# EAGLE design Gesture_rf_controller_v1 (EAGLE 7.1.0)
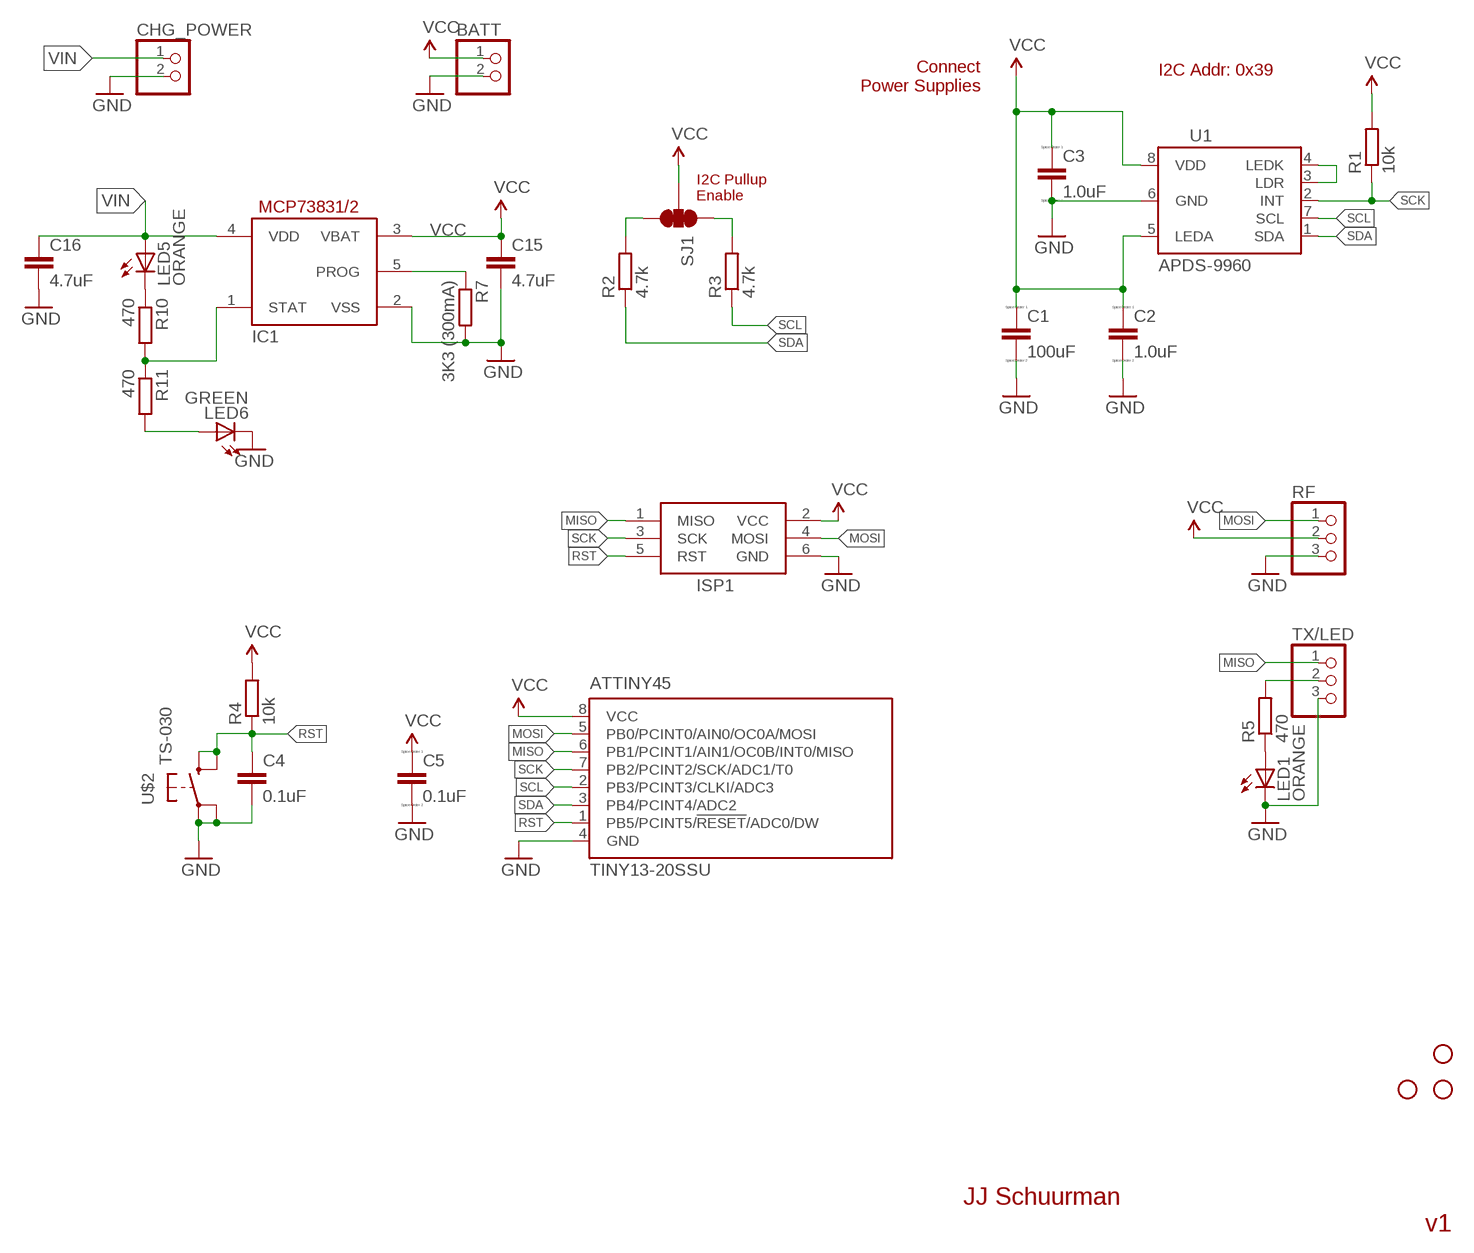
[diagram p0: schematic, sheet 1]

## Parts
ATTINY45  TINY13-20SSU  [8S1]
BATT  PINHD-1X2  [1X02]
C1  100uF  C-EUC0805  [C0805]
C2  1.0uF  C-EUC0805  [C0805]
C3  1.0uF  C-EUC0805  [C0805]
C4  0.1uF  C-EUC1206  [C1206]
C5  0.1uF  C-EUC0805  [C0805]
C15  4.7uF  C-EUC0805K  [C0805K]
C16  4.7uF  C-EUC0805K  [C0805K]
CHG_POWER  PINHD-1X2  [1X02]
IC1  MCP73831/OT  [SOT23-5L]
ISP1  AVRISP-6  [AVRISP]
LED1  ORANGE  LEDCHIP-LED0805  [CHIP-LED0805]
LED5  ORANGE  LEDCHIPLED_0805  [CHIPLED_0805]
LED6  GREEN  LEDCHIPLED_0805  [CHIPLED_0805]
R1  10k  R-EU_R0805  [R0805]
R2  4.7k  R-EU_R1206  [R1206]
R3  4.7k  R-EU_R1206  [R1206]
R4  10k  R-EU_M0805  [M0805]
R5  470  R-EU_R0805  [R0805]
R7  3K3 (300mA)  R-EU_M1206  [M1206]
R10  470  R-EU_M0805  [M0805]
R11  470  R-EU_M0805  [M0805]
RF  PINHD-1X3  [1X03]
SJ1  SOLDERJUMPER_2WAYPASTE1&2&3  [SJ_3_PASTE1&2&3]
STANDOFF1  STAND-OFF  [STAND-OFF]
STANDOFF2  STAND-OFF  [STAND-OFF]
STANDOFF4  STAND-OFF  [STAND-OFF]
TX/LED  PINHD-1X3  [1X03]
U1  APDS-9960  [APDS-9960]
U$2  TS-030  [TS-030]

## Nets
GND: ATTINY45.4(GND) BATT.2 C1.2 C2.2 C3.2 C4.2 C5.2 C15.2 C16.2 CHG_POWER.2 IC1.2(VSS) ISP1.6(GND) LED1.C LED6.C R7.2 RF.3 TX/LED.3 U1.6(GND) U$2.P$2 U$2.P$3
MISO: ATTINY45.6(PB1/PCINT1/AIN1/OC0B/INT0/MISO) ISP1.1(MISO) TX/LED.1
MOSI: ATTINY45.5(PB0/PCINT0/AIN0/OC0A/MOSI) ISP1.4(MOSI) RF.1
N$1: R2.2 SJ1.3
N$2: R3.2 SJ1.1
N$3: LED1.A R5.1
N$4: U1.3(LDR) U1.4(LEDK)
N$17: IC1.5(PROG) R7.1
N$19: LED5.C R10.1
N$20: IC1.1(STAT) R10.2 R11.1
N$21: LED6.A R11.2
RST: ATTINY45.1(PB5/PCINT5/!RESET!/ADC0/DW) C4.1 ISP1.5(RST) R4.1 U$2.P$1 U$2.P$4
SCK: ATTINY45.7(PB2/PCINT2/SCK/ADC1/T0) ISP1.3(SCK) R1.1 U1.2(INT)
SCL: ATTINY45.2(PB3/PCINT3/CLKI/ADC3) R3.1 U1.7(SCL)
SDA: ATTINY45.3(PB4/PCINT4/ADC2) R2.1 U1.1(SDA)
TX/LED: R5.2 TX/LED.2
VCC: ATTINY45.8(VCC) BATT.1 C1.1 C2.1 C3.1 C5.1 C15.1 IC1.3(VBAT) ISP1.2(VCC) R1.2 R4.2 RF.2 SJ1.2 U1.5(LEDA) U1.8(VDD)
VIN: C16.1 CHG_POWER.1 IC1.4(VDD) LED5.A

## Notes on the sheet
- Connect
  Power Supplies
- I2C Addr: 0x39
- I2C Pullup
  Enable
- JJ Schuurman
- v1

## Library data of the parts
ATTINY45 = atmel:TINY13: 8-bit AVR Microcontroller with 1K Bytes In-System Programmable Flash Source: http://www.atmel.com/dyn/resources/prod_documents/2535S.pdf; MPN: ATTINY13-20SSU; OC_FARNELL: 1455133; OC_NEWARK: 58M3771
BATT CHG_POWER = pinhead:PINHD-1X2: PIN HEADER
C1-C3 C5 = resistor:C-EU: CAPACITOR, European symbol; SPICEPREFIX: C
C4 C15 C16 = rcl:C-EU: CAPACITOR, European symbol
IC1 = adafruit:MCP73831: MCP73831/2 Miniature Single-Cell, Fully Integrated Li-Ion, Li-Polymer Charge Management Controllers. Nice and small simple lipoly charge controller, with adjustable current and status output (LED) http://www.ladyada.net/library/pcb/eaglelibrary.html
ISP1 = adafruit:AVRISP: AVR ISP HEADER Standard 6 pin header for AVR programming
LED1 = adafruit:LED: LED
LED5 LED6 = led:LED: LED
R1-R5 R7 R10 R11 = resistor:R-EU_: RESISTOR, European symbol
RF TX/LED = pinhead:PINHD-1X3: PIN HEADER
SJ1 = SparkFun-Passives:SOLDERJUMPER_2WAY: Solder Jumper 2 way solder jumper
STANDOFF1 STANDOFF2 STANDOFF4 = SparkFun-Electromechanical:STAND-OFF: #4 Stand Off This is the mechanical footprint for a #4 phillips button head screw. Use the keepout ring to avoid running the screw head into surrounding components. SKU : PRT-00447
U1 = SparkFun-Sensors:APDS-9960: Avago APDS-9960 digital proximity, ambient light, RGB, and gesture sensor.; PROD_ID: SEN-12005
U$2 = switch-tact:TS-030

## Net classes
1 VCC: width 0.381 mm

## Board
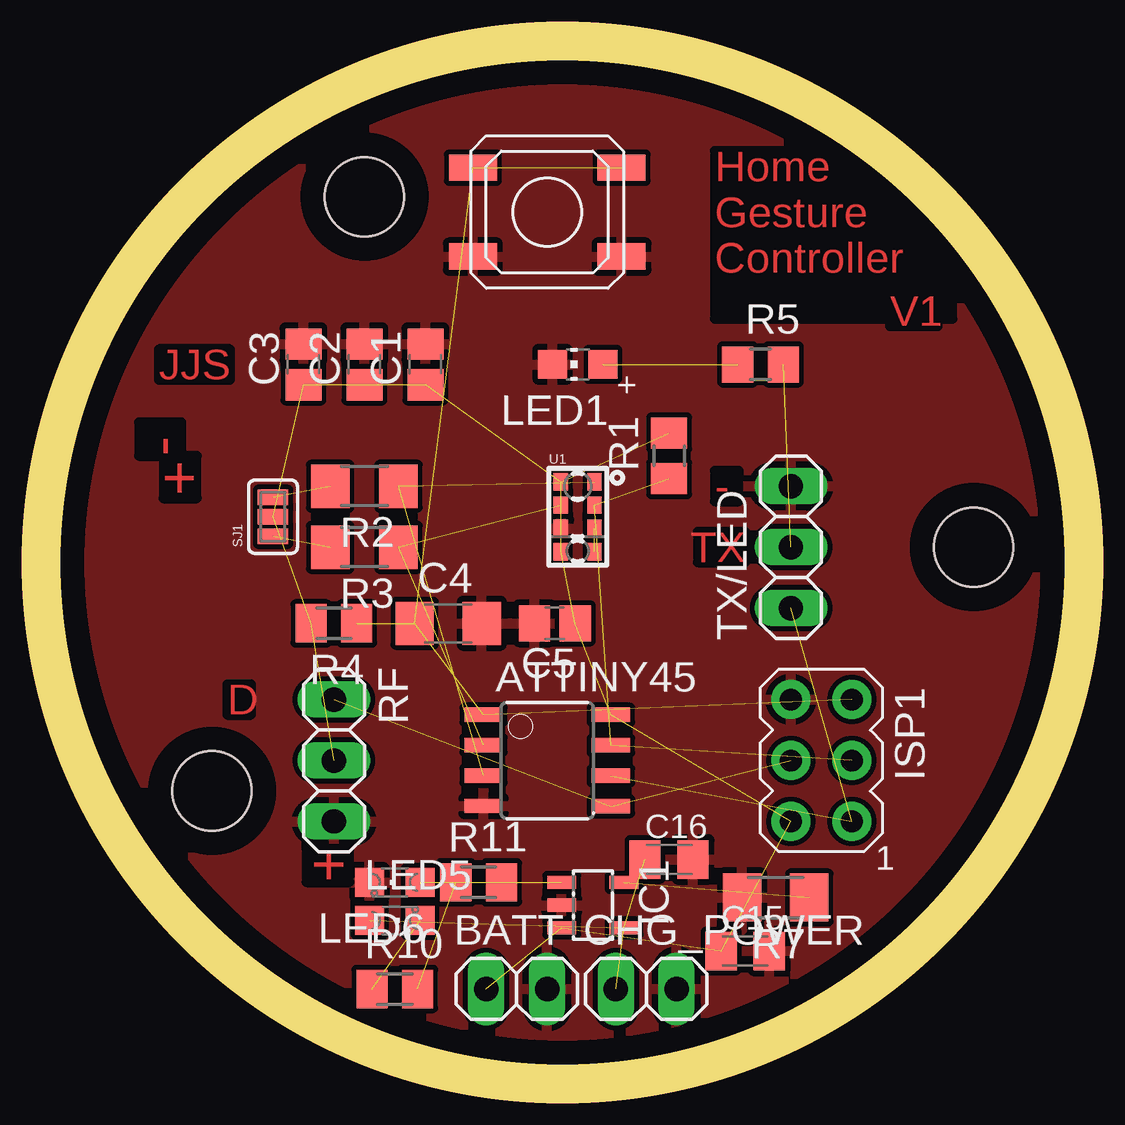
[diagram p1: board, top side]

Size 41.89 x 41.89 mm. Coordinates in mm from the lower left corner, seen from the top.
Outline: circle at 20.95,20.95 radius 20.95
Copper layers (1*16): Top 0.035mm / dielectric 1.5mm / Bottom 0.035mm
Design rules "default": minimum track width 10mil, minimum drill 24mil, track to track 8mil, track to pad 8mil, pad to pad 8mil, via to via 8mil, smd to smd 8mil, copper to edge 40mil, drill to drill 8mil, minimum pad ring 10mil, minimum via ring 8mil, stop-mask expansion 4mil, vias tented up to drill 0mil, thermal gap 10mil
Milling: area -0.8,-0.8 to 42.7,42.7

### Footprints (pad centres in the part's own frame; a part is rotated, then mirrored left to right if it is on the bottom)
8S1 = smd 0.6 x 1.6: 1 -1.905,-2.654; 2 -0.645,-2.654; 3 0.625,-2.654; 4 1.895,-2.654; 5 1.905,2.654; 6 0.635,2.654; 7 -0.635,2.654; 8 -1.905,2.654
1X02 = drill 1.016 long: 1 -1.27,0; 2 1.27,0
C0805 = smd 1.3 x 1.5: 1 -0.85,0; 2 0.85,0
C1206 = smd 1.6 x 1.8: 1 -1.4,0; 2 1.4,0
C0805K = smd 1.3 x 1.6: 1 -1,0; 2 1,0
SOT23-5L = smd 0.55 x 1.2: 1 -0.95,-1.3; 2 0,-1.3; 3 0.95,-1.3; 4 0.95,1.3; 5 -0.95,1.3
AVRISP = drill 0.9 pad 1.626: 1 -1.27,2.54; 2 1.27,2.54; 3 -1.27,0; 4 1.27,0; 5 -1.27,-2.54; 6 1.27,-2.54
CHIP-LED0805 = smd 1.2 x 1.2: A 0,-1.05; C 0,1.05
CHIPLED_0805 = smd 1.2 x 1.2: A 0,-1.05; C 0,1.05
R0805 = smd 1.3 x 1.5: 1 -0.95,0; 2 0.95,0
R1206 = smd 1.6 x 1.803: 1 -1.422,0; 2 1.422,0
M0805 = smd 1.3 x 1.6: 1 -0.95,0; 2 0.95,0
M1206 = smd 1.6 x 2: 1 -1.4,0; 2 1.4,0
1X03 = drill 1.016 long: 1 -2.54,0; 2 0,0; 3 2.54,0
SJ_3_PASTE1&2&3 = smd 0.635 x 1.27: 1 -0.813,0; 2 0,0; 3 0.813,0
STAND-OFF = hole 3.302: 0,0
APDS-9960 = smd 0.6 x 0.72: 1 0.7,1.455; 2 0.7,0.485; 3 0.7,-0.485; 4 0.7,-1.455; 5 -0.7,-1.455; 6 -0.7,-0.485; 7 -0.7,0.485; 8 -0.7,1.455
TS-030 = smd 2 x 1.1: P$1 3.1,1.85; P$2 3.1,-1.85; P$3 -3.1,-1.85; P$4 -3.1,1.85

### Placement (x,y rotation side)
ATTINY45  20.31,12.69 270 top
BATT  19.04,3.17 0 top
C1  15.23,29.2 90 top
C2  12.69,29.2 90 top
C3  10.15,29.2 90 top
C4  16.18,18.41 0 top
C5  20.63,18.41 180 top
C15  28.57,4.75 0 top
C16  25.39,8.56 0 top
CHG_POWER  24.44,3.17 0 top
IC1  22.22,6.66 270 top
ISP1  31.74,12.69 180 top
LED1  21.58,29.2 90 top
LED5  13.96,6.02 270 top
LED6  13.96,7.61 90 top
R1  25.39,25.39 90 top
R2  12.69,24.12 180 top
R3  12.69,21.58 180 top
R4  11.42,18.41 180 top
R5  29.2,29.2 0 top
R7  29.84,6.98 180 top
R10  13.96,3.17 0 top
R11  17.45,7.61 0 top
RF  11.42,12.69 270 top
SJ1  8.88,22.85 90 top
STANDOFF1  6.34,11.42 0 top
STANDOFF2  38.09,21.58 0 top
STANDOFF4  12.69,36.19 0 top
TX/LED  30.47,21.58 90 top
U1  21.58,22.85 0 top
U$2  20.31,35.55 0 top

### Tracks (layer width: path | path; a pad name or v marks a point on that pad's centre or on a via)
GND
  pour Top: -0.64,43.81 43.81,43.81 45.08,-1.28 -0.64,-1.28
MISO  (2 unrouted)
MOSI  (2 unrouted)
N$1  (1 unrouted)
N$2  (1 unrouted)
N$3  (1 unrouted)
N$4  (1 unrouted)
N$5
  Top 0.406: 10.15,29.84 10.47,29.84
N$17  (1 unrouted)
N$19  (1 unrouted)
N$20  (2 unrouted)
N$21  (1 unrouted)
RST  (5 unrouted)
SCK  (3 unrouted)
SCL  (2 unrouted)
SDA  (2 unrouted)
TX/LED  (1 unrouted)
VCC  (14 unrouted)
VIN  (3 unrouted)

### Text on the board
Top: Home / Gesture / Controller | V1 | JJS | - | + | - | TX | D | +